# Altium schematic sheet Voltage_Regulators.SchDoc
size B; Date: 24-02-02; CheckedBy: Jude Thibeault; Author: Kyle Dick; CompanyName: Conestoga College; DrawnBy: Kyle Dick; Engineer: Kyle Dick; Address1: 850 Fountain St.; DocumentNumber: 1; Revision: 3; SheetNumber: 1; SheetTotal: 3
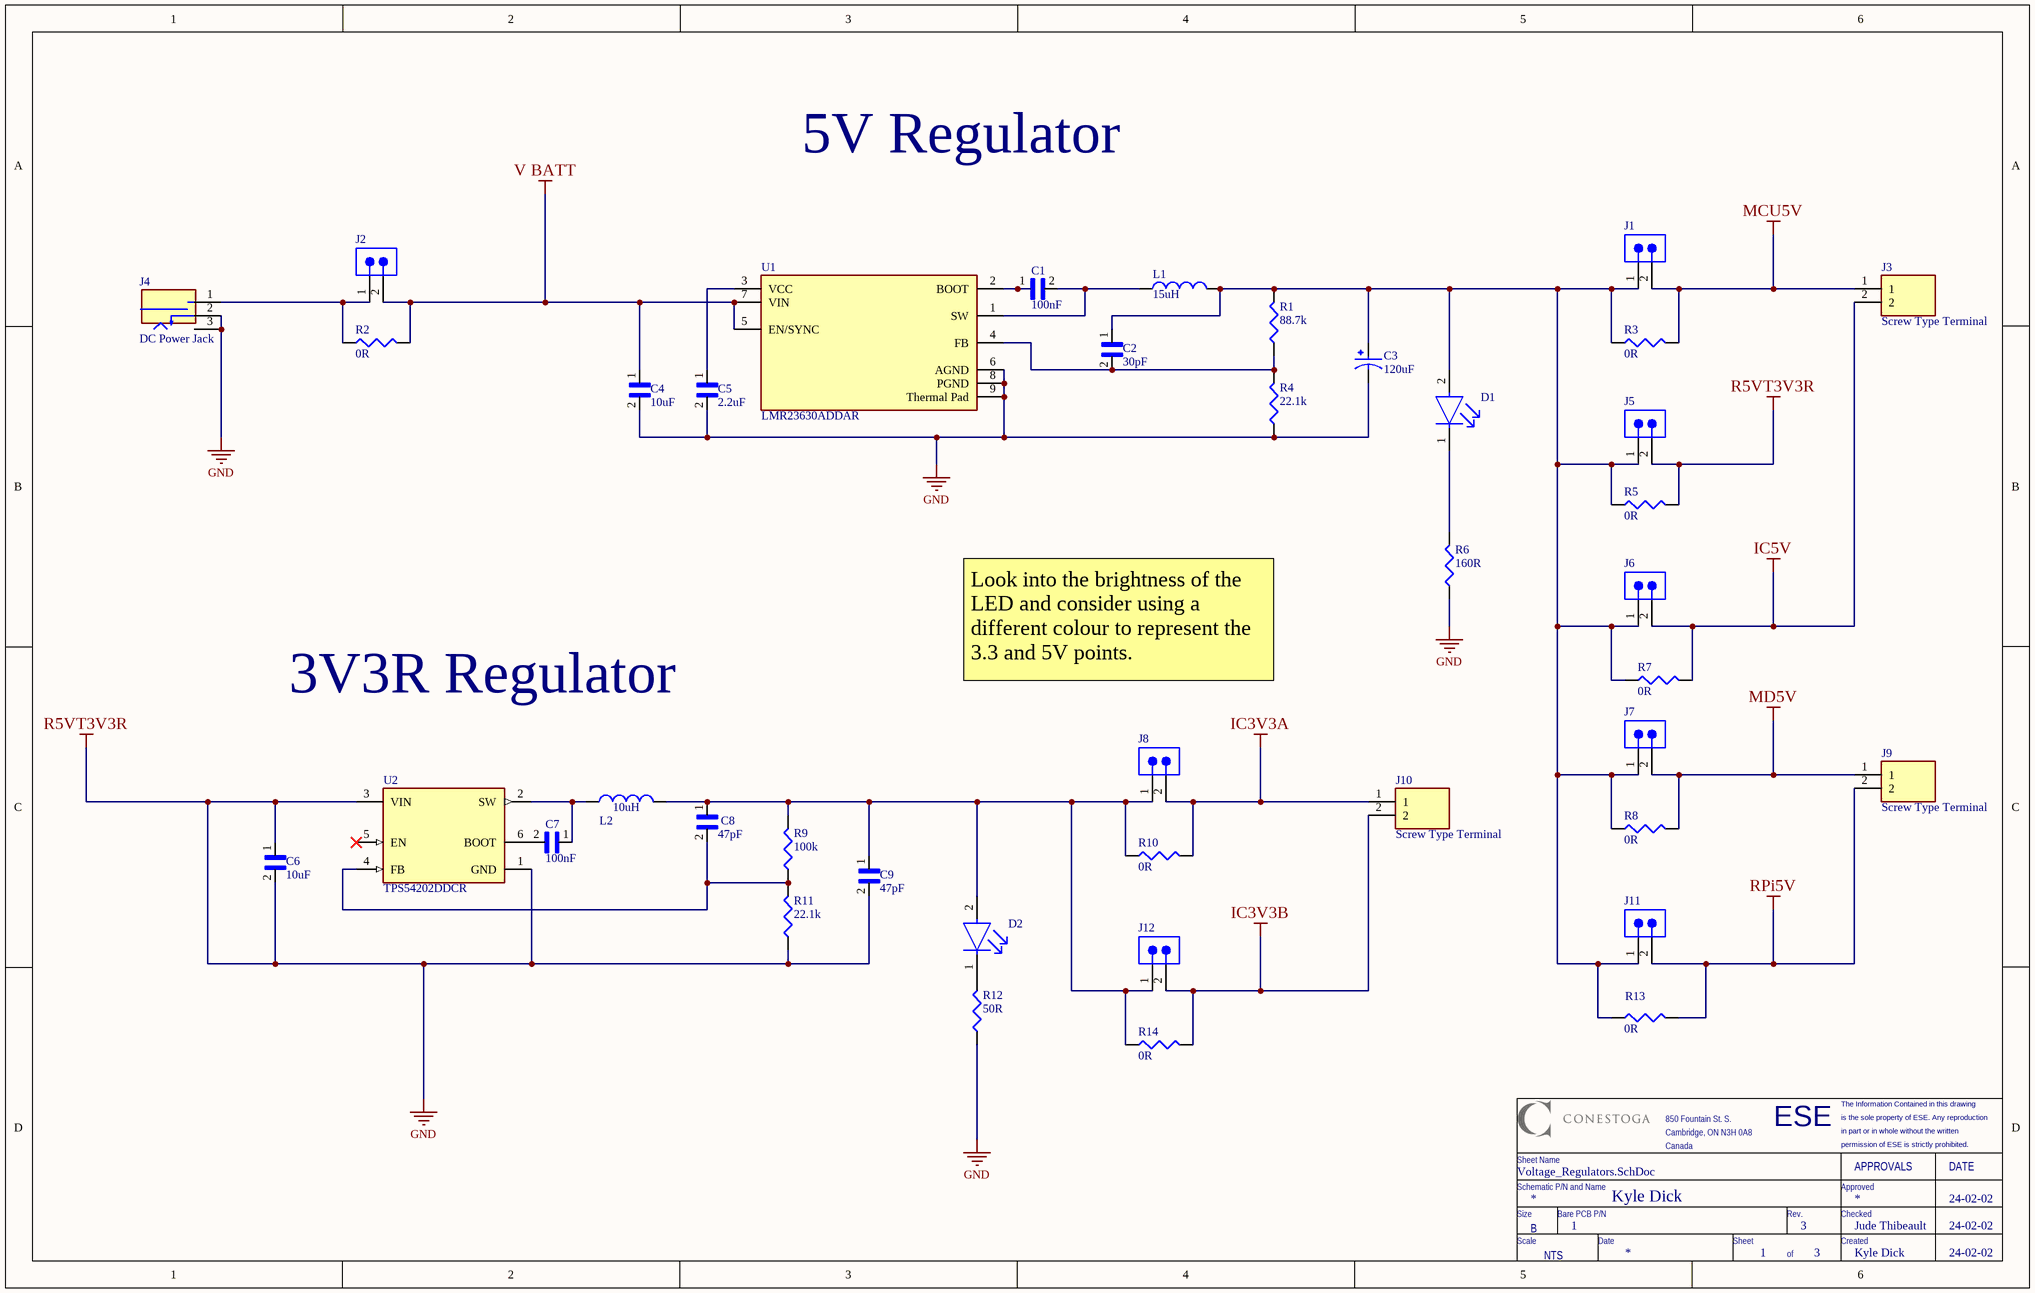
[diagram p0: Voltage_Regulators.SchDoc]

## Parts
C1  100nF  [10 uF Cap]
C2  30pF  [10 uF Cap]
C3  120uF  [Capacitor 120uF]
C4  10uF  [10 uF Cap]
C5  2.2uF  [10 uF Cap]
C6  10uF  [10 uF Cap]
C7  100nF  [10 uF Cap]
C8  47pF  [10 uF Cap]
C9  47pF  [10 uF Cap]
D1  LTST-C190GKT  [FP-LTST-C190GKT-MFG]  (value not drawn)
D2  LTST-C190GKT  [FP-LTST-C190GKT-MFG]  (value not drawn)
J1  61300211121  [61300211121]  (value not drawn)
J2  61300211121  [61300211121]  (value not drawn)
J3  Screw Type Terminal  [2 Pin Terminal Blue Screw]
J4  DC Power Jack  [GRAVITECH_CON-SOCJ-2155]
J5  61300211121  [61300211121]  (value not drawn)
J6  61300211121  [61300211121]  (value not drawn)
J7  61300211121  [61300211121]  (value not drawn)
J8  61300211121  [61300211121]  (value not drawn)
J9  Screw Type Terminal  [2 Pin Terminal Blue Screw]
J10  Screw Type Terminal  [2 Pin Terminal Blue Screw]
J11  61300211121  [61300211121]  (value not drawn)
J12  61300211121  [61300211121]  (value not drawn)
L1  15uH  [15uH Inductor]
L2  10uH  [10uH Inductor]  (value not drawn)
R1  88.7k  [RESC2112X05M]
R2  0R  [RESC2112X05M]
R3  0R  [RESC2112X05M]
R4  22.1k  [RESC2112X05M]
R5  0R  [RESC2112X05M]
R6  160R  [RESC2112X05M]
R7  0R  [RESC2112X05M]
R8  0R  [RESC2112X05M]
R9  100k  [RESC2112X05M]
R10  0R  [RESC2112X05M]
R11  22.1k  [RESC2112X05M]
R12  50R  [RESC2112X05M]
R13  0R  [RESC2112X05M]
R14  0R  [RESC2112X05M]
U1  LMR23630ADDAR  [FP-DDA0008E-MFG]
U2  TPS54202DDCR  [FP-DDC0006A-IPC_B]

## Nets
GND: C3.2 C4.2 C5.2 C6.1 C6.2 C9.2 J4.2 J4.3 J5.2 R4.1 R5.2 R6.1 R11.1 R12.1 U1.6(AGND) U1.8(PGND) U1.9(Thermal_Pad) U2.1(GND) U2.3(VIN)  [also labelled R5VT3V3R]
IC3V3A: J8.2 J10.1 R10.2
IC3V3B: J10.2 J12.2 R14.2
IC5V: J3.2 J6.2 R7.2
MCU5V: J1.2 J3.1 R3.2
MD5V: J7.2 J9.1 R8.2
RPi5V: J9.2 J11.2 R13.2
V BATT: C4.1 J2.2 R2.2 U1.5(EN/SYNC) U1.7(VIN)
NetC1_1: C1.1 U1.2(BOOT)
NetC1_2: C1.2 L1.1 U1.1(SW)
NetC2_1: C2.1 C3.1 D1.2(A) J1.1 J5.1 J6.1 J7.1 J11.1 L1.2 R1.2 R3.1 R5.1 R7.1 R8.1 R13.1
NetC2_2: C2.2 R1.1 R4.2 U1.4(FB)
NetC5_1: C5.1 U1.3(VCC)
NetC7_1: C7.1 L2.1 U2.2(SW)
NetC7_2: C7.2 U2.6(BOOT)
NetC8_1: C8.1 C9.1 D2.2(A) J8.1 J12.1 L2.2 R9.2 R10.1 R14.1
NetC8_2: C8.2 R9.1 R11.2 U2.4(FB)
NetD1_1: D1.1(C) R6.2
NetD2_1: D2.1(C) R12.2
NetJ2_1: J2.1 J4.1 R2.1

Not connected (* = marked no-connect by the designer): U2 5(EN)*

## Notes on the sheet
- 5V Regulator
- 3V3R Regulator
- Look into the brightness of the LED and consider using a different colour to represent the 3.3 and 5V points.
- Kyle Dick
- ESE
- is the sole property of ESE. Any reproduction
- The Information Contained in this drawing
- Schematic P/N and Name
- Sheet Name
- 850 Fountain St. S.
- Cambridge, ON N3H 0A8
- Canada
- Approved
- in part or in whole without the written
- permission of ESE is strictly prohibited.
- APPROVALS
- DATE
- Size
- Scale
- B
- NTS
- Bare PCB P/N
- Date
- Sheet
- Rev.
- Checked
- Created
- of

## Library data of the parts
C1 C7 = Capacitor 0.1uF: Ceramic Capacitor 1210; MF: Samsung Electro-Mechanics; MP: CL32A106KBJNNNE; Check_prices: https://www.snapeda.com/parts/CL32A106KBJNNNE/Samsung%20Electro-Mechanics/view-part/3598300/?ref=eda; Value: *; SnapEDA_Link: https://www.snapeda.com/parts/CL32A106KBJNNNE/Samsung%20Electro-Mechanics/view-part/3598300/?ref=snap; Package: 1210 Samsung; Availability: Unavailable; Price: None; Supplier 1: Mouser; Supplier Part Number 1: 80-C1210C104K1R
C2 = Capacitor 30pF: Ceramic Capacitor 1210; MF: Samsung Electro-Mechanics; MP: CL32A106KBJNNNE; Check_prices: https://www.snapeda.com/parts/CL32A106KBJNNNE/Samsung%20Electro-Mechanics/view-part/3598300/?ref=eda; Value: *; SnapEDA_Link: https://www.snapeda.com/parts/CL32A106KBJNNNE/Samsung%20Electro-Mechanics/view-part/3598300/?ref=snap; Package: 1210 Samsung; Availability: Unavailable; Price: None; Supplier 1: Digikey; Supplier Part Number 1: 478-KGQ32DCG2D300JTCT-ND
C3 = Capacitor 120uF_1: 120 µF 10 V Aluminum - Polymer Capacitors Radial, Can - SMD 27mOhm 2000 Hrs @ 105°C; MP: 10SVPC120M; Package: None; Price: None; Availability: Unavailable; Value: *
C4 C6 = Capacitor 10uF: Ceramic Capacitor 1210; MF: Samsung Electro-Mechanics; MP: CL32A106KBJNNNE; Check_prices: https://www.snapeda.com/parts/CL32A106KBJNNNE/Samsung%20Electro-Mechanics/view-part/3598300/?ref=eda; Value: *; SnapEDA_Link: https://www.snapeda.com/parts/CL32A106KBJNNNE/Samsung%20Electro-Mechanics/view-part/3598300/?ref=snap; Package: 1210 Samsung; Availability: Unavailable; Price: None; Supplier 1: Avnet; Supplier Part Number 1: CL32A106KBJNNNE
C5 = Capacitor 2.2uF: Ceramic Capacitor 1210; MF: Samsung Electro-Mechanics; MP: CL32A106KBJNNNE; Check_prices: https://www.snapeda.com/parts/CL32A106KBJNNNE/Samsung%20Electro-Mechanics/view-part/3598300/?ref=eda; Value: *; SnapEDA_Link: https://www.snapeda.com/parts/CL32A106KBJNNNE/Samsung%20Electro-Mechanics/view-part/3598300/?ref=snap; Package: 1210 Samsung; Availability: Unavailable; Price: None; Supplier 1: Avnet; Supplier Part Number 1: 41AH7123
C8 C9 = Capacitor 47pF: Ceramic Capacitor 1210; MF: Samsung Electro-Mechanics; MP: CL32A106KBJNNNE; Check_prices: https://www.snapeda.com/parts/CL32A106KBJNNNE/Samsung%20Electro-Mechanics/view-part/3598300/?ref=eda; Value: *; SnapEDA_Link: https://www.snapeda.com/parts/CL32A106KBJNNNE/Samsung%20Electro-Mechanics/view-part/3598300/?ref=snap; Package: 1210 Samsung; Availability: Unavailable; Price: None; Supplier 1: Digikey; Supplier Part Number 1: 478-KGQ32DCG2D300JTCT-ND
D1 D2 = CMP-22017-000005-2: LED GREEN CLEAR CHIP SMD; Dominant Wavelength: 569nm; Reverse Voltage: 5V; Lens Color: Colorless; Viewing Angle: 130°; Voltage: 2V; Forward Current: 30mA; Power Dissipation: 100mW; Luminous Intensity: 6mcd; Number of LEDs: 1; Forward Voltage: 2.1V; Wavelength: 565nm; Test Current: 10mA; Min Operating Temperature: -55°C; Lens Style: Clear; Mount: Surface Mount; Width: 0.8mm; Packaging: Tape and Reel; Lens Transparency: Clear; Case Code (Metric): 1608; Depth: 0.8mm; Case Code (Imperial): 0603; Case/Package: 0603; Number of Pins: 2; Max Operating Temperature: 85°C; Lead Free: Lead Free; Number of Elements: 1; Length: 1.6mm; Height: 0.8mm; Package Quantity: 1; Power Rating: 100mW; Radiation Hardening: No; Illumination Color: Green; Color: Green
J1 J2 J5-J8 J11 J12 = CMP-1712-00002-5: NexarPartId: 20081794; Operating Supply Voltage: 250V; Current Rating: 3A; Gender: Male; Number of Contacts: 2; Pitch: 2.54mm; Connector Type: Male Pin; Contact Resistance: 20mΩ; Contact Plating: Gold; Contact Material: Copper; Number of Pins: 2; Min Operating Temperature: -40°C; Packaging: Bulk; Lead Pitch: 2.54mm; Mount: Through Hole; Orientation: Vertical; RoHS: Compliant; REACH SVHC: No SVHC; Height: 8.94mm; Termination: Through Hole; Number of Positions: 2; Contact Mating Length: 5.9944mm; Color: Black; Contact Gender: Male; Number of Rows: 1; Housing Material: PBT; Lead Free: Lead Free; Voltage Rating: 250V; Max Operating Temperature: 125°C
J3 J9 J10 = Screw Type Terminal: 2~24 Poles, Screw Type, Horizontal, 5.0 Pitch, 22~12 (AWG), Terminal Block Connector; MP: TB002-500-02BE; MF: CUI Devices; Purchase-URL: https://pricing.snapeda.com/search/part/TB002-500-02BE/?ref=eda; Package: None; Price: None; Availability: In Stock; SnapEDA_Link: https://www.snapeda.com/parts/TB002-500-02BE/CUI+Devices/view-part/?ref=snap; Value: *; Check_prices: https://www.snapeda.com/parts/TB002-500-02BE/CUI+Devices/view-part/?ref=eda; CUI_purchase_URL: https://www.cuidevices.com/product/interconnect/connectors/terminal-blocks/tb002-500-series?utm_source=snapeda.com&utm_medium=referral&utm_campaign=snapedaBOM
J4 = DC Power Jack: DC Power Connectors Power Jack/Connector 2.1mm x 5.5mm; MF: Gravitech; MP: CON-SOCJ-2155; Package: None; Value: *; Availability: In Stock; Check_prices: https://www.snapeda.com/parts/CON-SOCJ-2155/Gravitech/view-part/?ref=eda; SnapEDA_Link: https://www.snapeda.com/parts/CON-SOCJ-2155/Gravitech/view-part/?ref=snap; Price: None
L1 = Inductor: 15 µH Unshielded Wirewound Inductor 4 A 36mOhm Max Nonstandard; SimulationGenericComponent: True; Value: 15uH
L2 = Inductor_2: 10 µH Unshielded Wirewound Inductor 2.6 A 60mOhm Max 2424 (6060 Metric); SimulationGenericComponent: True
R1 = Resistor 88.7k: 88.7k 1206 smd; Supplier: Arrow Electronics; Supplier Part Number: RMCF1206FT10K0; Supplier 1: Arrow Electronics; Supplier Part Number 1: ERJ-8ENF8872V
R2 R3 R5 R7 R8 R10 R13 R14 = Resistor 0R: 0R 1206 smd; Supplier: Arrow Electronics; Supplier Part Number: RMCF1206FT10K0; Supplier 1: Avnet; Supplier Part Number 1: 84W7269
R4 R11 = Resistor 22.1k: 22.1k 1206 smd; Supplier: Arrow Electronics; Supplier Part Number: RMCF1206FT10K0; Supplier 1: Avnet; Supplier Part Number 1: RMCF1206FT22K1
R6 = Resistor 160R: 1206 smd; Supplier: Arrow Electronics; Supplier Part Number: RMCF1206FT10K0; Supplier 1: Arrow Electronics; Supplier Part Number 1: RMCF1206FT160R
R9 = Resistor 100k: 100k 1206 smd; Supplier: Arrow Electronics; Supplier Part Number: RMCF1206FT10K0; Supplier 1: Arrow Electronics; Supplier Part Number 1: RMCF1206FT10K0
R12 = Resistor 50R: 50R 1206 smd; Supplier: Arrow Electronics; Supplier Part Number: RMCF1206FT10K0; Supplier 1: Mouser; Supplier Part Number 1: 71-RCP1206W50R0GEB
U1 = CMP-04918-000336-1: IC REG BUCK ADJUSTABLE 3A 8SOPWR; Synchronous Rectifier: Yes; Min Output Voltage: 1V; Switching Frequency: 2.425MHz; Max Input Voltage: 36V; Output Configuration: Positive; Number of Outputs: 1; Min Input Voltage: 4V; Max Output Voltage: 28V; Quiescent Current: 75uA; Mount: Surface Mount; Min Operating Temperature: -40°C; Output Type: Adjustable; Packaging: Tape and Reel; Output Current: 3A; RoHS Compliant: Yes; Max Operating Temperature: 125°C; Lead Free: Lead Free; Number of Pins: 8
U2 = CMP-04918-000439-1: IC REG BUCK ADJ 2A TSOT23-6; Switching Frequency: 500kHz; Quiescent Current: 40uA; Max Output Voltage: 28V; Output Configuration: Positive; Min Output Voltage: 596mV; Min Input Voltage: 4.5V; Synchronous Rectifier: Yes; Output Type: Adjustable; Number of Outputs: 1; Packaging: Tape and Reel; Case/Package: SOT-23-6; RoHS Compliant: Yes; Max Input Voltage: 28V; Max Operating Temperature: 125°C; Min Operating Temperature: -40°C; Output Current: 2A; Lead Free: Lead Free; Mount: Surface Mount